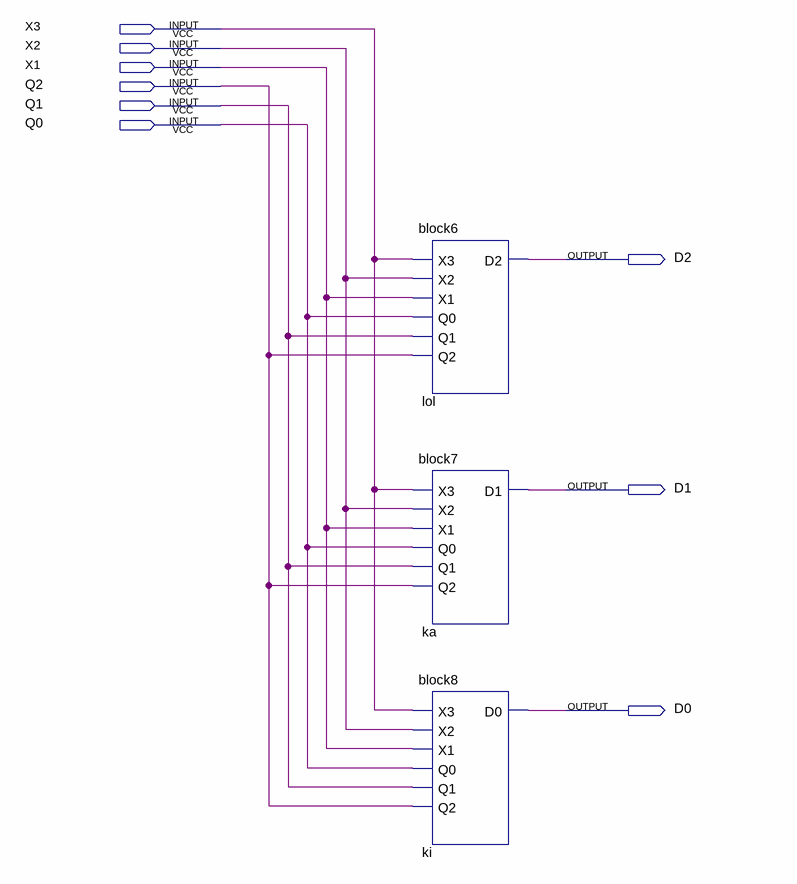
[diagram p0: schematic sheet]
// Quartus schematic block9.bdf as structural Verilog: 3 symbols, 9 pins
module block9 (
  input  X3,
  input  X2,
  input  X1,
  input  Q2,
  input  Q1,
  input  Q0,
  output D2,
  output D1,
  output D0
);

  block6 lol (.X3(X3), .X2(X2), .X1(X1), .Q0(Q0), .Q1(Q1), .Q2(Q2), .D2(D2));
  block7 ka (.X3(X3), .X2(X2), .X1(X1), .Q0(Q0), .Q1(Q1), .Q2(Q2), .D1(D1));
  block8 ki (.X3(X3), .X2(X2), .X1(X1), .Q0(Q0), .Q1(Q1), .Q2(Q2), .D0(D0));
endmodule
